# Altium project UAV.PrjPcb
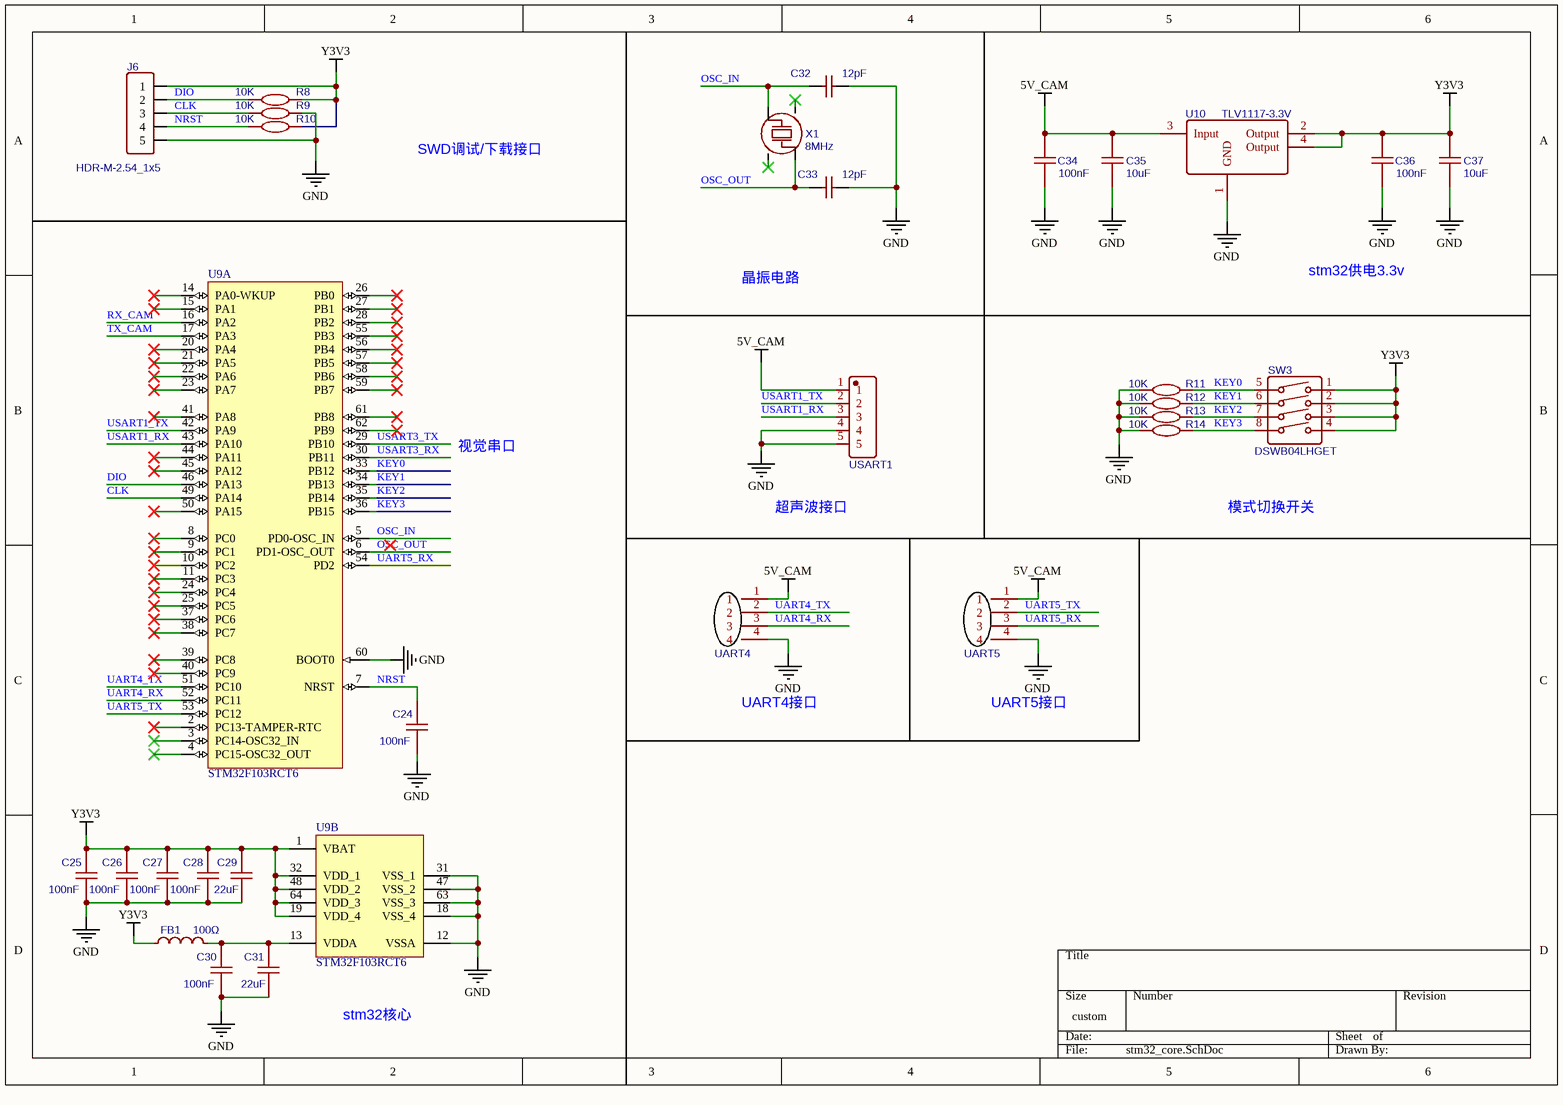
[diagram p0: stm32_core.SchDoc]
2 sheets, 83 parts. Net scope: global (net labels, ports and power ports of the same name join across sheets).
Board file: Devkit_board.PcbDoc
Sheets:
  stm32_core.SchDoc
  IMU.SchDoc

## Sheet stm32_core.SchDoc
size 292 x 203 mm

### Parts
C24  100nF  [C0402]
C25  100nF  [C0402]
C26  100nF  [C0402]
C27  100nF  [C0402]
C28  100nF  [C0402]
C29  22uF  [C0603]
C30  100nF  [C0402]
C31  22uF  [C0603]
C32  12pF  [C0402]
C33  12pF  [C0402]
C34  100nF  [C0402]
C35  10uF  [C0805]
C36  100nF  [C0402]
C37  10uF  [C0805]
FB1  100Ω  [L0603]
J6  HDR-M-2.54_1x5  [HDR-M-2.54_1X5]
R8  10K  [R0402]
R9  10K  [R0402]
R10  10K  [R0402]
R11  10K  [R0402]
R12  10K  [R0402]
R13  10K  [R0402]
R14  10K  [R0402]
SW3  DSWB04LHGET  [SW-TH_DSWB04LHGET]
U9  STM32F103RCT6  [STM-LQFP64_N]  (parts A,B of 2)
U10  TLV1117-3.3V  [SOT-223-4_L6.5-W3.5-P2.30-LS7.0-BR]
UART4  XH-4A  [CONN-TH_4P-P2.50_XH-4A]  (value not drawn)
UART5  XH-4A  [CONN-TH_4P-P2.50_XH-4A]  (value not drawn)
USART1  XH-5A  [CONN-TH_5P-P2.50_XH-5A_C2318]  (value not drawn)
X1  8MHz  [OSC-SMD_4P-L3.2-W2.5-BL]

### Nets
5V_CAM: C34.2 C35.2 U10.3(Input) UART4.1 UART5.1 USART1.1
GND: C24.1 C25.1 C26.1 C27.1 C28.1 C29.1 C30.1 C31.1 C32.1 C33.1 C34.1 C35.1 C36.1 C37.1 J6.5 R9.2 R11.1 R12.1 R13.1 R14.1 U9.12(VSSA) U9.18(VSS_4) U9.31(VSS_1) U9.47(VSS_2) U9.60(BOOT0) U9.63(VSS_3) U10.1(GND) UART4.4 UART5.4 USART1.4 USART1.5
Y3V3: C25.2 C26.2 C27.2 C28.2 C29.2 C36.2 C37.2 FB1.1 J6.1 R8.2 R10.2 SW3.1 SW3.2 SW3.3 SW3.4 U9.1(VBAT) U9.19(VDD_4) U9.32(VDD_1) U9.48(VDD_2) U9.64(VDD_3) U10.2(Output) U10.4(Output)
CLK: J6.3 R9.1 U9.49(PA14)
DIO: J6.2 R8.1 U9.46(PA13)
KEY0: R11.2 SW3.5 U9.33(PB12)
KEY1: R12.2 SW3.6 U9.34(PB13)
KEY2: R13.2 SW3.7 U9.35(PB14)
KEY3: R14.2 SW3.8 U9.36(PB15)
NRST: C24.2 J6.4 R10.1 U9.7(NRST)
OSC_IN: C32.2 U9.5(PD0-OSC_IN) X1.3
OSC_OUT: C33.2 U9.6(PD1-OSC_OUT) X1.1
RX_CAM: U9.16(PA2)
TX_CAM: U9.17(PA3)
UART4_RX: U9.52(PC11) UART4.3
UART4_TX: U9.51(PC10) UART4.2
UART5_RX: U9.54(PD2) UART5.3
UART5_TX: U9.53(PC12) UART5.2
USART1_RX: U9.43(PA10) USART1.3
USART1_TX: U9.42(PA9) USART1.2
USART3_RX: U9.30(PB11)
USART3_TX: U9.29(PB10)
NetC30_2: C30.2 C31.2 FB1.2 U9.13(VDDA)

Not connected (* = marked no-connect by the designer): U9 2(PC13-TAMPER-RTC)* 3(PC14-OSC32_IN)* 4(PC15-OSC32_OUT)* 8(PC0)* 9(PC1)* 10(PC2)* 11(PC3)* 14(PA0-WKUP)* 15(PA1)* 20(PA4)* 21(PA5)* 22(PA6)* 23(PA7)* 24(PC4)* 25(PC5)* 26(PB0)* 27(PB1)* 28(PB2)* 37(PC6)* 38(PC7)* 39(PC8)* 40(PC9)* 41(PA8)* 44(PA11)* 45(PA12)* 50(PA15)* 55(PB3)* 56(PB4)* 57(PB5)* 58(PB6)* 59(PB7)* 61(PB8)* 62(PB9)*; X1 2* 4*

### Notes on the sheet
- SWD调试/下载接口
- 晶振电路
- stm32供电3.3v
- 视觉串口
- 超声波接口
- 模式切换开关
- UART4接口
- UART5接口
- stm32核心

### Library data of the parts
C24-C28 C30 C34 C36 = 100nF: BOM_Manufacturer: Taiyo Yuden; BOM_Manufacturer Part: TMK105B7104KVHF; nameAlias: Capacitance; Contributor: LCSC; BOM_Supplier: LCSC; BOM_Supplier Part: C386075; spicePre: C; spiceSymbolName: TMK105B7104KVHF
C29 C31 = 22uF: BOM_Manufacturer: Taiyo Yuden; BOM_Manufacturer Part: LDK107BBJ226MA-T; nameAlias: Capacitance; Contributor: LCSC; BOM_Supplier: LCSC; BOM_Supplier Part: C337440; spicePre: C; spiceSymbolName: LDK107BBJ226MA-T
C32 C33 = 12pF: BOM_Manufacturer: TAIYO YUDEN; BOM_Manufacturer Part: UMK105CG120JV-F; nameAlias: Capacitance; BOM_Supplier: LCSC; BOM_Supplier Part: C92842; spicePre: C; spiceSymbolName: UMK105CG120JV-F
C35 C37 = 10uF: BOM_Manufacturer: Taiyo Yuden; BOM_Manufacturer Part: TMK212BBJ106KG-T; nameAlias: Capacitance; Contributor: LCSC; BOM_Supplier: LCSC; BOM_Supplier Part: C386085; spicePre: C; spiceSymbolName: TMK212BBJ106KG-T
FB1 = 100Ω: BOM_Manufacturer: TDK; BOM_Manufacturer Part: MPZ1608D101BTA00; nameAlias: Value; BOM_Supplier: LCSC; BOM_Supplier Part: C87554; spicePre: L; spiceSymbolName: MPZ1608D101BTA00
J6 = HDR-M-2.54_1x5: Contributor: LCEDA_Lib; BOM_Supplier Part: C358687; BOM_Supplier: LCSC; spicePre: J; spiceSymbolName: HDR-M-2.54_1x5
R8-R14 = 10K: BOM_Manufacturer: YAGEO; BOM_Manufacturer Part: AC0402FR-0710KL; nameAlias: Resistance (Ohms); Contributor: LCSC; BOM_Supplier: LCSC; BOM_Supplier Part: C144807; spicePre: R; spiceSymbolName: AC0402FR-0710KL
SW3 = DSWB04LHGET: BOM_Manufacturer: Dongguan Guangzhu Industrial; Contributor: LCSC; BOM_Paste Type: expand; BOM_Assembly Type: manualWeld; BOM_Supplier: LCSC; BOM_Supplier Part: C99418; BOM_Manufacturer Part: -; spicePre: S; spiceSymbolName: DSWB04LHGET
U9 = STM32F103RCT6: ARM Cortex-M3 32-bit MCU, 256 KB Flash, 48 KB Internal RAM, 51 I/Os, 64-pin LQFP, -40 to 85 degC, Tray; A/D Converter: 3x12-bit (16 Channel); D/A Converter: 2x12-bit (2 Channel); FLASH Size (Prog) (kB): 256; I/Os (High Current): 51; Internal RAM Size (kB): 48; Operating Frequency(F) (Processor speed) (MHz): 72; Supply Voltage(Vcc) min (V): 2; DatasheetVersion: Rev. 8; PackageVersion: Rev. 4, 06/2013; PackageReference: LQFP64; PackageDescription: 64-Pin Low Profile Quad Flat Package, 10 x 10 mm Body, 0.5 mm Pitch; Supplier 1: Digi-Key; Supplier Part Number 1: 497-9033-ND; Supplier 2: Newark; Supplier Part Number 2: 01P4099; Supplier 3: Newark; Supplier Part Number 3: 57P1227; Supplier 4: Mouser; Supplier Part Number 4: 511-STM32F103RCT6; Core: ARM Cortex-M3; Packing: Tray; Mounting Technology: Surface Mount; PartNumber: STM32F103RCT6; ComponentLink1Description: Manufacturer URL; ComponentLink1URL: http://www.st.com/web/en/home.html; ComponentLink2Description: Datasheet; ComponentLink2URL: http://www.st.com/st-web-ui/static/active/en/resource/technical/document/datasheet/CD00191185.pdf; ComponentLink3Description: Package Specification; ComponentLink3URL: http://www.st.com/st-web-ui/static/active/en/resource/technical/document/datasheet/DM00037051.pdf
U10 = TLV1117-3.3V: BOM_Manufacturer: TI; BOM_Manufacturer Part: TLV1117-33IDCYR; SMT Type: Extend; BOM_Supplier: LCSC; image: //image.lceda.cn/szlcsc/C37359.jpg; BOM_Supplier Part: C37359; BOM_JLCPCB SMD: Yes; spicePre: U; spiceSymbolName: TLV1117-33IDCYR
UART4 UART5 = XH-4A: BOM_Manufacturer: BOOMELE; SMT Type: Extend; BOM_Supplier: LCSC; BOM_Manufacturer Part: XH-4A; image: //image.lceda.cn/szlcsc/C37815.jpg; BOM_Supplier Part: C37815; BOM_JLCPCB SMD: Yes; spicePre: C; spiceSymbolName: XH-4A
USART1 = XH-5A: BOM_Manufacturer: BOOMELE; SMT Type: Extend; BOM_Supplier: LCSC; BOM_Manufacturer Part: XH-5A; image: //image.lceda.cn/szlcsc/C2318.jpg; BOM_Supplier Part: C2318; BOM_JLCPCB SMD: Yes; spicePre: C; spiceSymbolName: XH-5A
X1 = 8MHz: BOM_Manufacturer: Zhejiang Abel Elec; BOM_Manufacturer Part: TAXM8M4RDBCCT2T; nameAlias: Frequency; Contributor: LCSC; BOM_Paste Type: expand; BOM_Assembly Type: smtWeld; BOM_Supplier: LCSC; BOM_Supplier Part: C400090; spicePre: X; spiceSymbolName: TAXM8M4RDBCCT2T

## Sheet IMU.SchDoc
size 330 x 228 mm
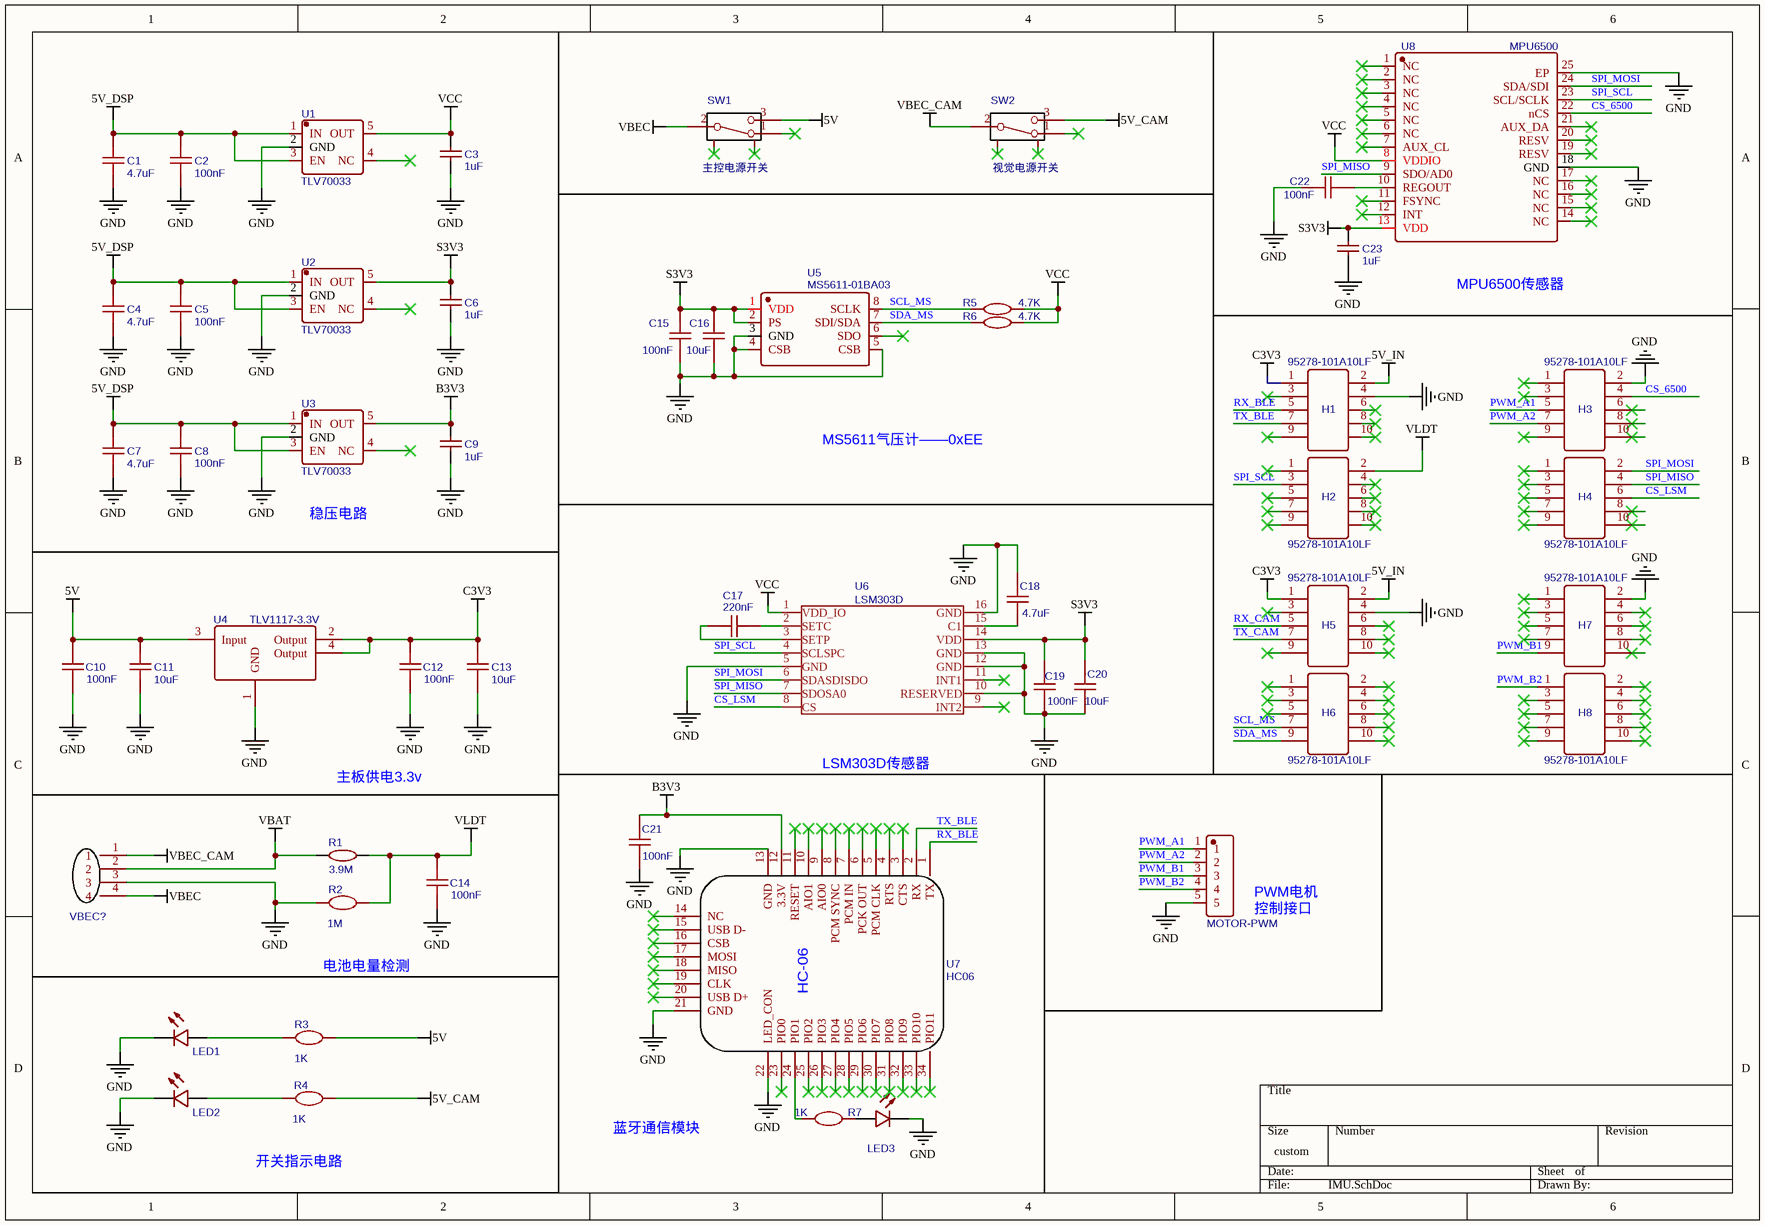
[diagram p1: IMU.SchDoc]

### Parts
C1  4.7uF  [C0603]
C2  100nF  [C0402]
C3  1uF  [C0402]
C4  4.7uF  [C0603]
C5  100nF  [C0402]
C6  1uF  [C0402]
C7  4.7uF  [C0603]
C8  100nF  [C0402]
C9  1uF  [C0402]
C10  100nF  [C0402]
C11  10uF  [C0805]
C12  100nF  [C0402]
C13  10uF  [C0805]
C14  100nF  [C0402]
C15  100nF  [C0402]
C16  10uF  [C0805]
C17  220nF  [C0402]
C18  4.7uF  [C0603]
C19  100nF  [C0402]
C20  10uF  [C0805]
C21  100nF  [C0402]
C22  100nF  [C0402]
C23  1uF  [C0402]
H1  95278-101A10LF  [HDR-SMD_10P-P2.54-V-R2-C5-S7.3]
H2  95278-101A10LF  [HDR-SMD_10P-P2.54-V-R2-C5-S7.3]
H3  95278-101A10LF  [HDR-SMD_10P-P2.54-V-R2-C5-S7.3]
H4  95278-101A10LF  [HDR-SMD_10P-P2.54-V-R2-C5-S7.3]
H5  95278-101A10LF  [HDR-SMD_10P-P2.54-V-R2-C5-S7.3]
H6  95278-101A10LF  [HDR-SMD_10P-P2.54-V-R2-C5-S7.3]
H7  95278-101A10LF  [HDR-SMD_10P-P2.54-V-R2-C5-S7.3]
H8  95278-101A10LF  [HDR-SMD_10P-P2.54-V-R2-C5-S7.3]
LED1  19-217/BHC-ZL1M2RY/3T  [LED0603-R-RD]  (value not drawn)
LED2  19-217/BHC-ZL1M2RY/3T  [LED0603-R-RD]  (value not drawn)
LED3  19-217/BHC-ZL1M2RY/3T  [LED0603-R-RD]  (value not drawn)
MOTOR-PWM  XH-5A  [CONN-TH_5P-P2.50_XH-5A_C2318]  (value not drawn)
R1  3.9M  [R0402]
R2  1M  [R0402]
R3  1K  [R0402]
R4  1K  [R0402]
R5  4.7K  [R0402]
R6  4.7K  [R0402]
R7  1K  [R0402]
SW1  主控电源开关  [SW-TH_SK-12D02VG3]
SW2  视觉电源开关  [SW-TH_SK-12D02VG3]
U1  TLV70033  [SC-70-5_L2.1-W1.3-P0.65-LS2.1-BR]
U2  TLV70033  [SC-70-5_L2.1-W1.3-P0.65-LS2.1-BR]
U3  TLV70033  [SC-70-5_L2.1-W1.3-P0.65-LS2.1-BR]
U4  TLV1117-3.3V  [SOT-223-4_L6.5-W3.5-P2.30-LS7.0-BR]
U5  MS5611-01BA03  [SENSORS-SMD_MS5611-01BA03]
U6  LSM303D  [LGA16-0.5-3X3MM]
U7  HC06  [HC-06 MODULE]
U8  MPU6500  [QFN-24_L3.0-W3.0-P0.40-BL-EP]
VBEC?  XH-4A  [CONN-TH_4P-P2.50_XH-4A]  (value not drawn)

### Nets
5V: C10.2 C11.2 R3.2 SW1.3 U4.3(Input)
5V_CAM: R4.2 SW2.3
5V_DSP: C1.2 C2.2 C4.2 C5.2 C7.2 C8.2 U1.1(IN) U1.3(EN) U2.1(IN) U2.3(EN) U3.1(IN) U3.3(EN)
5V_IN: H1.2 H5.2
B3V3: C9.2 C21.1 U3.5(OUT) U7.12(3.3V)
C3V3: C12.2 C13.2 H1.1 H5.1 U4.2(Output) U4.4(Output)
GND: C1.1 C2.1 C3.1 C4.1 C5.1 C6.1 C7.1 C8.1 C9.1 C10.1 C11.1 C12.1 C13.1 C14.1 C15.1 C16.1 C18.2 C19.1 C20.1 C21.2 C22.2 C23.1 H1.4 H3.2 H5.4 H7.2 LED1.2(C) LED2.2(C) LED3.2(C) MOTOR-PWM.5 R2.1 U1.2(GND) U2.2(GND) U3.2(GND) U4.1(GND) U5.3(GND) U5.4(CSB) U5.5(CSB) U6.5(GND) U6.10(RESERVED) U6.12(GND) U6.13(GND) U6.16(GND) U7.13(GND) U7.21(GND) U7.22(LED_CON) U8.18(GND) U8.25(EP) VBEC?.3
S3V3: C6.2 C15.2 C16.2 C19.2 C20.2 C23.2 U2.5(OUT) U5.1(VDD) U5.2(PS) U6.14(VDD) U8.13(VDD)
VBAT: R1.1 VBEC?.2
VBEC: SW1.2 VBEC?.4
VBEC_CAM: SW2.2 VBEC?.1
VCC: C3.2 R5.2 R6.2 U1.5(OUT) U6.1(VDD_IO) U8.8(VDDIO)
VLDT: C14.2 H2.2 R1.2 R2.2
CS_6500: H3.4 U8.22(nCS)
CS_LSM: H4.6 U6.8(CS)
PWM_A1: H3.5 MOTOR-PWM.1
PWM_A2: H3.7 MOTOR-PWM.2
PWM_B1: H7.9 MOTOR-PWM.3
PWM_B2: H8.1 MOTOR-PWM.4
RX_BLE: H1.5 U7.1(TX)
RX_CAM: H5.5
SCL_MS: H6.7 R5.1 U5.8(SCLK)
SDA_MS: H6.9 R6.1 U5.7(SDI/SDA)
SPI_MISO: H4.4 U6.7(SDOSA0) U8.9(SDO/AD0)
SPI_MOSI: H4.2 U6.6(SDASDISDO) U8.24(SDA/SDI)
SPI_SCL: H2.3 U6.4(SCLSPC) U8.23(SCL/SCLK)
TX_BLE: H1.7 U7.2(RX)
TX_CAM: H5.7
NetC17_1: C17.1 U6.3(SETP)
NetC17_2: C17.2 U6.2(SETC)
NetC18_1: C18.1 U6.15(C1)
NetC22_1: C22.1 U8.10(REGOUT)
NetLED1_1: LED1.1(A) R3.1
NetLED2_1: LED2.1(A) R4.1
NetLED3_1: LED3.1(A) R7.1
NetR7_2: R7.2 U7.24(PIO1)

Not connected (* = marked no-connect by the designer): H1 3* 6* 8* 9* 10*; H2 1* 4* 5* 6* 7* 8* 9* 10*; H3 1* 3* 6* 8* 9* 10*; H4 1* 3* 5* 7* 8* 9* 10*; H5 3* 6* 8* 9* 10*; H6 1* 2* 3* 4* 5* 6* 8* 10*; H7 1* 3* 4* 5* 6* 7* 8* 10*; H8 2* 3* 4* 5* 6* 7* 8* 9* 10*; SW1 1* 4* 5*; SW2 1* 4* 5*; U1 4(NC)*; U2 4(NC)*; U3 4(NC)*; U5 6(SDO)*; U6 9(INT2)* 11(INT1)*; U7 3(CTS)* 4(RTS)* 5(PCM_CLK)* 6(PCK_OUT)* 7(PCM_IN)* 8(PCM_SYNC)* 9(AIO0)* 10(AIO1)* 11(RESET)* 14(NC)* 15(USB_D-)* 16(CSB)* 17(MOSI)* 18(MISO)* 19(CLK)* 20(USB_D+)* 23(PIO0)* 25(PIO2)* 26(PIO3)* 27(PIO4)* 28(PIO5)* 29(PIO6)* 30(PIO7)* 31(PIO8)* 32(PIO9)* 33(PIO10)* 34(PIO11)*; U8 1(NC)* 2(NC)* 3(NC)* 4(NC)* 5(NC)* 6(NC)* 7(AUX_CL)* 11(FSYNC)* 12(INT)* 14(NC)* 15(NC)* 16(NC)* 17(NC)* 19(RESV)* 20(RESV)* 21(AUX_DA)*

### Notes on the sheet
- (near U8) MPU6500传感器
- MS5611气压计——0xEE
- 稳压电路
- (near U6) LSM303D传感器
- 主板供电3.3v
- 电池电量检测
- (near MOTOR-PWM) PWM电机
  控制接口
- 开关指示电路
- 蓝牙通信模块
- (in symbol HC06) HC-06

### Library data of the parts
C1 C4 C7 C18 = 4.7uF: BOM_Manufacturer: Taiyo Yuden; BOM_Manufacturer Part: TMK107BBJ475KA-T; nameAlias: Capacitance; Contributor: LCSC; BOM_Supplier: LCSC; BOM_Supplier Part: C268021; spicePre: C; spiceSymbolName: TMK107BBJ475KA-T
C2 C5 C8 C10 C12 C14 C15 C19 C21 C22 = 100nF: as C24 on sheet stm32_core; BOM_Supplier: LCSC; BOM_Supplier Part: C386075; spicePre: C; spiceSymbolName: TMK105B7104KVHF
C3 C6 C9 C23 = 1uF: BOM_Manufacturer: TAIYO YUDEN; BOM_Manufacturer Part: EMK105BJ105KV-F; nameAlias: Capacitance; BOM_Supplier: LCSC; BOM_Supplier Part: C92755; spicePre: C; spiceSymbolName: EMK105BJ105KV-F
C11 C13 C16 C20 = 10uF: as C35 on sheet stm32_core; BOM_Supplier: LCSC; BOM_Supplier Part: C386085; spicePre: C; spiceSymbolName: TMK212BBJ106KG-T
C17 = 220nF: BOM_Manufacturer: TAIYO YUDEN; BOM_Manufacturer Part: EMK105B7224KV-FR; nameAlias: Capacitance; BOM_Supplier: LCSC; BOM_Supplier Part: C92754; spicePre: C; spiceSymbolName: EMK105B7224KV-FR
H1-H8 = 95278-101A10LF: BOM_Manufacturer: Amphenol ICC; Contributor: LCSC; BOM_Supplier: LCSC; BOM_Supplier Part: C178296; BOM_Manufacturer Part: 95278-101A10LF; spicePre: H; spiceSymbolName: 95278-101A10LF
LED1-LED3 = 19-217/BHC-ZL1M2RY/3T: BOM_Manufacturer: EVERLIGHT; SMT Type: Basic; BOM_Supplier: LCSC; BOM_Manufacturer Part: 19-217/BHC-ZL1M2RY/3T; image: //image.lceda.cn/szlcsc/C72041.jpg; BOM_Supplier Part: C72041; BOM_JLCPCB SMD: Yes; spicePre: L; spiceSymbolName: 19-217/BHC-ZL1M2RY/3T
MOTOR-PWM = XH-5A: as USART1 on sheet stm32_core; BOM_Supplier: LCSC; BOM_Manufacturer Part: XH-5A; image: //image.lceda.cn/szlcsc/C2318.jpg; BOM_Supplier Part: C2318; BOM_JLCPCB SMD: Yes; spicePre: C; spiceSymbolName: XH-5A
R1 = 3.9M: BOM_Manufacturer: YAGEO; BOM_Manufacturer Part: RC0402JR-073M9L; nameAlias: Resistance (Ohms); BOM_Supplier: LCSC; BOM_Supplier Part: C137870; spicePre: R; spiceSymbolName: RC0402JR-073M9L
R2 = 1M: BOM_Manufacturer: YAGEO; BOM_Manufacturer Part: AF0402FR-071ML; Contributor: LCSC; BOM_Supplier: LCSC; BOM_Supplier Part: C723450; spicePre: R; spiceSymbolName: AF0402FR-071ML
R3 R4 R7 = 1K: BOM_Manufacturer: YAGEO; BOM_Manufacturer Part: AF0402FR-071KL; Contributor: LCSC; BOM_Supplier: LCSC; BOM_Supplier Part: C723478; spicePre: R; spiceSymbolName: AF0402FR-071KL
R5 R6 = 4.7K: BOM_Manufacturer: YAGEO; BOM_Manufacturer Part: AC0402JR-074K7L; nameAlias: Resistance (Ohms); Contributor: LCSC; BOM_Supplier: LCSC; BOM_Supplier Part: C144709; spicePre: R; spiceSymbolName: AC0402JR-074K7L
SW1 = 主控电源开关: BOM_Manufacturer: Rectangular Connectors - Contacts; BOM_Manufacturer Part: SK-12D02-VG5; Contributor: LCSC; BOM_Supplier: LCSC; BOM_Supplier Part: C136722; spicePre: S; spiceSymbolName: SK-12D02-VG5
SW2 = 视觉电源开关: BOM_Manufacturer: Rectangular Connectors - Contacts; BOM_Manufacturer Part: SK-12D02-VG5; Contributor: LCSC; BOM_Supplier: LCSC; BOM_Supplier Part: C136722; spicePre: S; spiceSymbolName: SK-12D02-VG5
U1-U3 = TLV70033: BOM_Manufacturer: TI; BOM_Manufacturer Part: TLV70033DCKR; SMT Type: Extend; spicePre: X; BOM_Supplier: LCSC; image: //image.lceda.cn/szlcsc/C47945.jpg; BOM_Supplier Part: C47945; BOM_JLCPCB SMD: Yes; spiceSymbolName: TLV70033DCKR
U4 = TLV1117-3.3V: as U10 on sheet stm32_core; BOM_Supplier: LCSC; image: //image.lceda.cn/szlcsc/C37359.jpg; BOM_Supplier Part: C37359; BOM_JLCPCB SMD: Yes; spicePre: U; spiceSymbolName: TLV1117-33IDCYR
U5 = MS5611-01BA03: BOM_Manufacturer: MEAS; BOM_Paste Type: expand; BOM_Assembly Type: smtWeld; BOM_Supplier: LCSC; BOM_Manufacturer Part: MS5611-01BA03; image: //image.lceda.cn/szlcsc/C37148.jpg; BOM_Supplier Part: C37148; spicePre: U; spiceSymbolName: MS5611-01BA03
U7 = HC06: Contributor: monday; BOM_Manufacturer Part: HC06; spicePre: U; spiceSymbolName: HC06
U8 = MPU6500: BOM_Manufacturer: InvenSense; SMT Type: Extend; BOM_Supplier: LCSC; BOM_Manufacturer Part: MPU6500; BOM_Supplier Part: C50278; BOM_JLCPCB SMD: Yes; spicePre: U; spiceSymbolName: MPU6500
VBEC? = XH-4A: as UART4 on sheet stm32_core; BOM_Supplier: LCSC; BOM_Manufacturer Part: XH-4A; image: //image.lceda.cn/szlcsc/C37815.jpg; BOM_Supplier Part: C37815; BOM_JLCPCB SMD: Yes; spicePre: C; spiceSymbolName: XH-4A
U6 = LSM303D: BOM_Manufacturer Part: LSM303D; spicePre: U; spiceSymbolName: LSM303D

## Nets that join several sheets
5V_CAM: stm32_core (6 pins), IMU (R4.2 SW2.3)
GND: stm32_core (31 pins), IMU (49 pins)
RX_CAM: stm32_core (U9.16), IMU (H5.5)
TX_CAM: stm32_core (U9.17), IMU (H5.7)